# EAGLE design Mainboard (EAGLE 6.4)
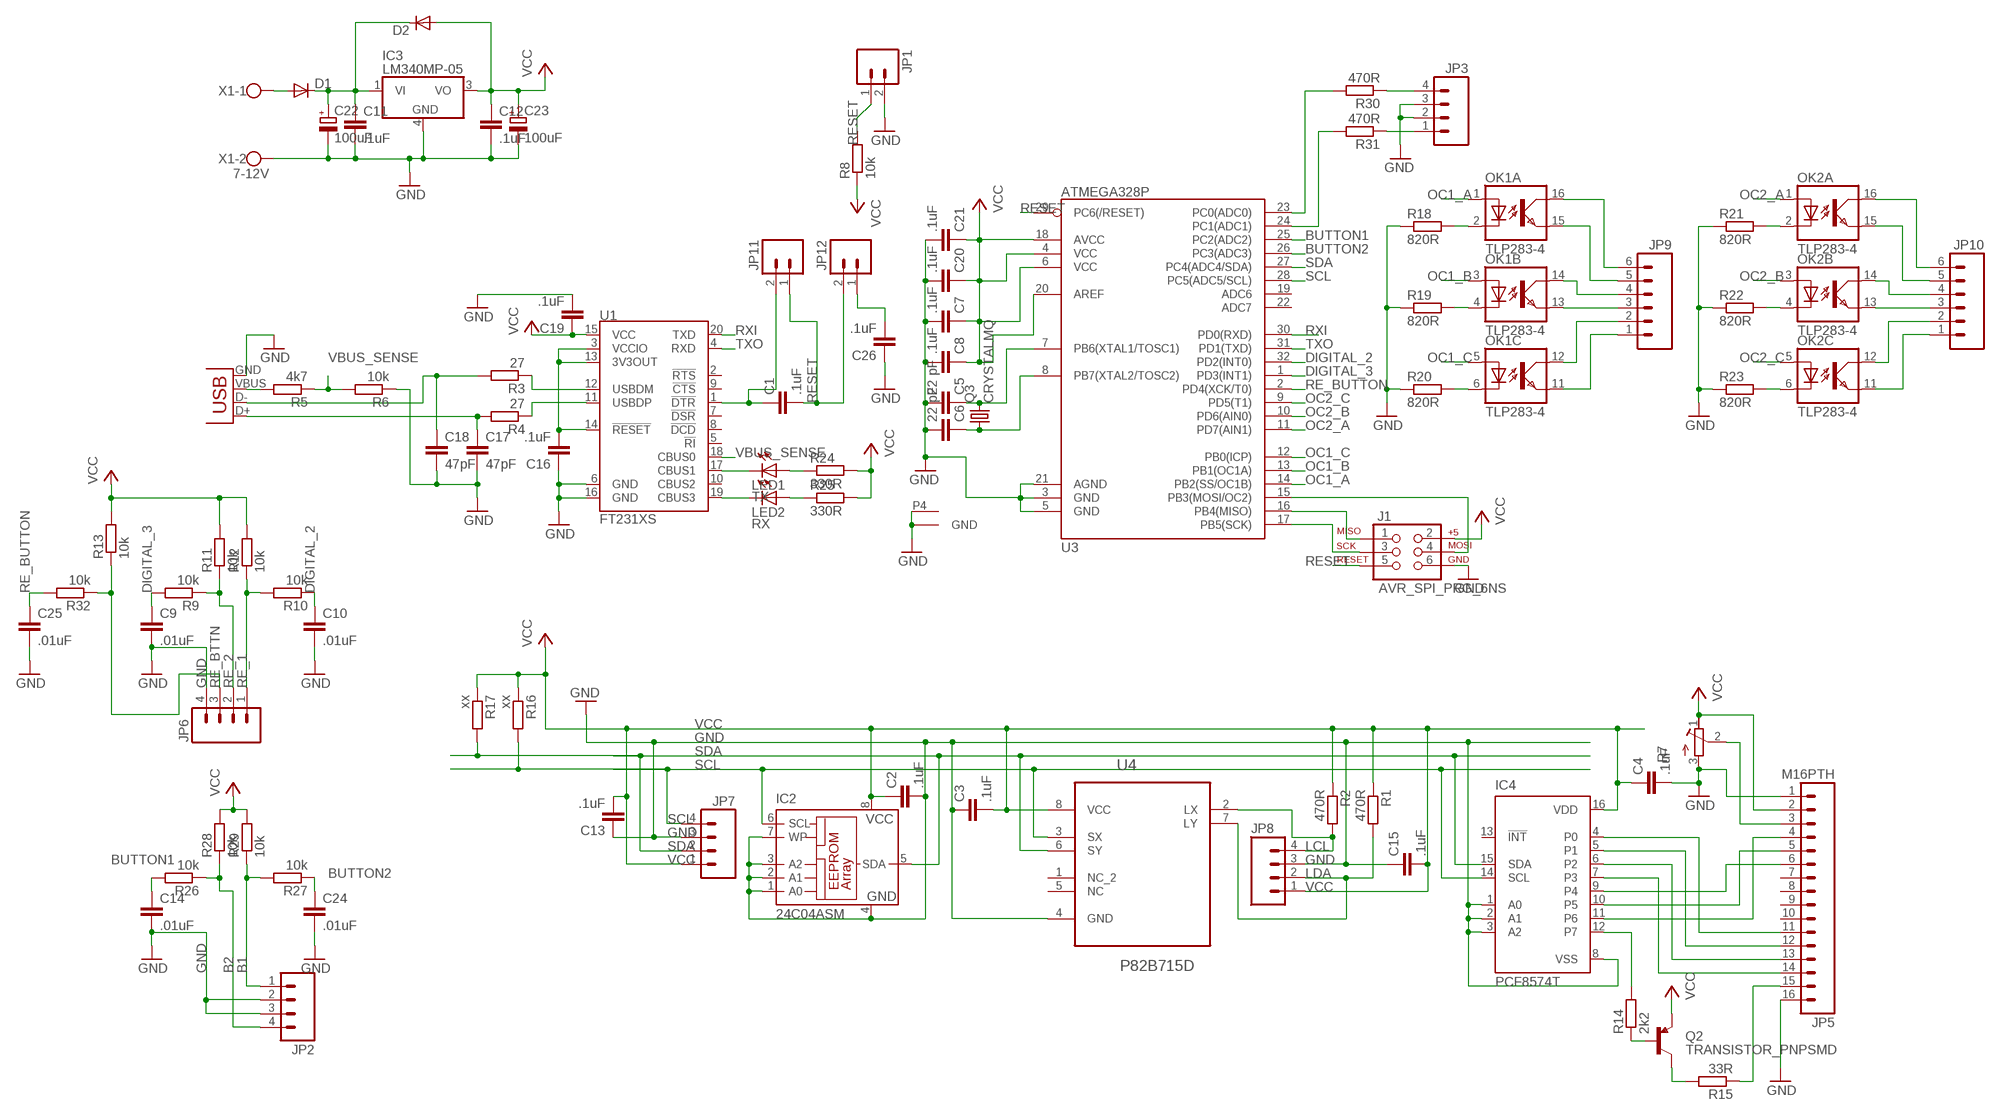
[diagram p0: schematic, sheet 1]

## Parts
C1  .1uF  C-EUC0805  [C0805]
C2  .1uF  C-EUC0805  [C0805]
C3  .1uF  C-EUC0805  [C0805]
C4  .1uF  C-EUC0805  [C0805]
C5  22 pF  C-EUC0805  [C0805]
C6  22 pF  C-EUC0805  [C0805]
C7  .1uF  C-EUC0805  [C0805]
C8  .1uF  C-EUC0805  [C0805]
C9  .01uF  C-EUC0805  [C0805]
C10  .01uF  C-EUC0805  [C0805]
C11  .1uF  C-EUC0805  [C0805]
C12  .1uF  C-EUC0805  [C0805]
C13  .1uF  C-EUC0805  [C0805]
C14  .01uF  C-EUC0805  [C0805]
C15  .1uF  C-EUC0805  [C0805]
C16  .1uF  C-EUC0805  [C0805]
C17  47pF  C-EUC0805  [C0805]
C18  47pF  C-EUC0805  [C0805]
C19  .1uF  C-EUC0805  [C0805]
C20  .1uF  C-EUC0805  [C0805]
C21  .1uF  C-EUC0805  [C0805]
C22  100uF  CPOL-EUD  [PANASONIC_D]
C23  100uF  CPOL-EUD  [PANASONIC_D]
C24  .01uF  C-EUC0805  [C0805]
C25  .01uF  C-EUC0805  [C0805]
C26  .1uF  C-EUC0805  [C0805]
D1  DIODE-MELF-MLL41  [MELF-MLL41]
D2  DIODE-MELF-MLL41  [MELF-MLL41]
IC2  24C04ASM  [SO-08M]
IC3  LM340MP-05  [SOT223]
IC4  PCF8574T  [SO16W]
J1  AVR_SPI_PRG_6NS  [2X3-NS]
JP1  M02POLAR  [MOLEX-1X2]
JP2  M04POLAR  [MOLEX-1X4]
JP3  M04PTH  [1X04]
JP4  USB-B  USBPTH  [USB-B-PTH]
JP5  M16PTH  [1X16]
JP6  M04POLAR  [MOLEX-1X4]
JP7  M04POLAR  [MOLEX-1X4]
JP8  M04POLAR  [MOLEX-1X4]
JP9  M06POLAR  [MOLEX-1X6]
JP10  M06POLAR  [MOLEX-1X6]
JP11  M02PTH  [1X02]
JP12  M02PTH  [1X02]
LED1  TX  LEDCHIPLED_0805  [CHIPLED_0805]
LED2  RX  LEDCHIPLED_0805  [CHIPLED_0805]
OK1  TLP283-4  [MINI-FLAT-16]
OK2  TLP283-4  [MINI-FLAT-16]
Q2  TRANSISTOR_PNPSMD  [SOT23-3]
Q3  CRYSTALMQ  [MQ]
R1  470R  R-EU_R0805  [R0805]
R2  470R  R-EU_R0805  [R0805]
R3  27  R-EU_R0805  [R0805]
R4  27  R-EU_R0805  [R0805]
R5  4k7  R-EU_R0805  [R0805]
R6  10k  R-EU_R0805  [R0805]
R7  R-TRIMM3314G  [RTRIM3314G]
R8  10k  R-EU_R0805  [R0805]
R9  10k  R-EU_R0805  [R0805]
R10  10k  R-EU_R0805  [R0805]
R11  10k  R-EU_R0805  [R0805]
R12  10k  R-EU_R0805  [R0805]
R13  10k  R-EU_R0805  [R0805]
R14  2k2  R-EU_R0805  [R0805]
R15  33R  R-EU_R0805  [R0805]
R16  xx  R-EU_R0805  [R0805]
R17  xx  R-EU_R0805  [R0805]
R18  820R  R-EU_R0805  [R0805]
R19  820R  R-EU_R0805  [R0805]
R20  820R  R-EU_R0805  [R0805]
R21  820R  R-EU_R0805  [R0805]
R22  820R  R-EU_R0805  [R0805]
R23  820R  R-EU_R0805  [R0805]
R24  330R  R-EU_R0805  [R0805]
R25  330R  R-EU_R0805  [R0805]
R26  10k  R-EU_R0805  [R0805]
R27  10k  R-EU_R0805  [R0805]
R28  10k  R-EU_R0805  [R0805]
R29  10k  R-EU_R0805  [R0805]
R30  470R  R-EU_R0805  [R0805]
R31  470R  R-EU_R0805  [R0805]
R32  10k  R-EU_R0805  [R0805]
U1  FT231XS  [SSOP20_L]
U3  ATMEGA328P  ATMEGA328_SMT  [TQFP32-08]
U4  P82B715D  [SOIC127P600X175-8N]
X1  7-12V  W237-102  [W237-102]

## Nets
B1: JP2.1 R27.2 R29.1
B2: JP2.4 R26.1 R28.1
BUTTON1: C14.1 R26.2 U3.25(PC2(ADC2))
BUTTON2: C24.1 R27.1 U3.26(PC3(ADC3))
D+: C17.1 JP4.D+ R4.2
D-: C18.1 JP4.D- R3.2
DIGITAL_2: C10.1 R10.1 U3.32(PD2(INT0))
DIGITAL_3: C9.1 R9.2 U3.1(PD3(INT1))
GND: C2.2 C3.1 C4.2 C5.2 C6.2 C7.2 C8.2 C9.2 C10.2 C11.2 C12.2 C13.1 C14.2 C15.1 C16.1 C17.2 C18.2 C19.2 C20.2 C21.2 C22.- C23.- C24.2 C25.2 C26.1 IC2.1(A0) IC2.2(A1) IC2.3(A2) IC2.4(GND) IC2.7(WP) IC3.4(GND) IC4.1(A0) IC4.2(A1) IC4.3(A2) IC4.8(VSS) J1.6 JP1.2 JP2.2 JP2.3 JP3.2 JP3.3 JP4.GND JP5.1 JP5.16 JP6.4 JP7.3 JP8.3 Q3.P2(GND) Q3.P4(GND1) R6.1 R7.3(A) R18.1 R19.1 R20.1 R21.1 R22.1 R23.1 U1.6(GND) U1.16(GND) U3.3(GND) U3.5(GND) U3.21(AGND) U4.4(GND) X1.2
LCL: JP8.4 R2.2 U4.2(LX)
LDA: JP8.2 R1.2 U4.7(LY)
MISO: J1.1 U3.16(PB4(MISO))
MOSI: J1.4 U3.15(PB3(MOSI/OC2))
N$1: LED2.C U1.19(CBUS3)
N$2: C1.1 JP11.2 U1.1(!DTR)
N$3: C16.2 U1.3(VCCIO) U1.13(3V3OUT) U1.14(!RESET)
N$4: JP3.4 R30.1
N$5: R3.1 U1.12(USBDM)
N$6: R4.1 U1.11(USBDP)
N$7: JP3.1 R31.1
N$8: R30.2 U3.23(PC0(ADC0))
N$9: R31.2 U3.24(PC1(ADC1))
N$10: Q2.1(B) R14.1
N$11: JP9.1 OK1.11(C:EMIT)
N$12: JP5.3 R7.2(S)
N$13: C11.1 C22.+ D1.C D2.C IC3.1(VI)
N$14: IC4.11(P6) JP5.4
N$15: IC4.10(P5) JP5.5
N$16: IC4.9(P4) JP5.6
N$17: IC4.4(P0) JP5.11
N$18: IC4.5(P1) JP5.12
N$19: IC4.6(P2) JP5.13
N$20: IC4.7(P3) JP5.14
N$21: C5.1 Q3.P3 U3.7(PB6(XTAL1/TOSC1))
N$22: C6.1 Q3.P1 U3.8(PB7(XTAL2/TOSC2))
N$23: IC4.12(P7) R14.2
N$24: JP5.15 R15.1
N$25: Q2.3(C) R15.2
N$26: OK1.2(A:C) R18.2
N$27: OK1.4(B:C) R19.2
N$28: OK1.6(C:C) R20.2
N$29: OK2.2(A:C) R21.2
N$30: OK2.4(B:C) R22.2
N$31: OK2.6(C:C) R23.2
N$32: LED1.C U1.17(CBUS1)
N$33: D1.A X1.1
N$34: JP9.2 OK1.12(C:COL)
N$35: LED1.A R24.1
N$36: LED2.A R25.1
N$37: JP9.3 OK1.13(B:EMIT)
N$38: JP9.4 OK1.14(B:COL)
N$39: JP9.5 OK1.15(A:EMIT)
N$40: JP9.6 OK1.16(A:COL)
N$41: JP10.3 OK2.13(B:EMIT)
N$42: JP10.4 OK2.14(B:COL)
N$43: JP10.5 OK2.15(A:EMIT)
N$44: JP10.6 OK2.16(A:COL)
N$45: JP10.2 OK2.12(C:COL)
N$46: JP10.1 OK2.11(C:EMIT)
N$48: C26.2 JP12.1
OC1_A: OK1.1(A:A) U3.14(PB2(SS/OC1B))
OC1_B: OK1.3(B:A) U3.13(PB1(OC1A))
OC1_C: OK1.5(C:A) U3.12(PB0(ICP))
OC2_A: OK2.1(A:A) U3.11(PD7(AIN1))
OC2_B: OK2.3(B:A) U3.10(PD6(AIN0))
OC2_C: OK2.5(C:A) U3.9(PD5(T1))
RE_1: JP6.1 R10.2 R12.1
RE_2: JP6.2 R9.1 R11.1
RE_BTTN: JP6.3 R13.1 R32.1
RE_BUTTON: C25.1 R32.2 U3.2(PD4(XCK/T0))
RESET: C1.2 J1.5 JP1.1 JP11.1 JP12.2 R8.2 U3.29(PC6(/RESET))
RXI: U1.20(TXD) U3.30(PD0(RXD))
SCK: J1.3 U3.17(PB5(SCK))
SCL: IC2.6(SCL) IC4.14(SCL) JP7.4 R16.2 U3.28(PC5(ADC5/SCL)) U4.3(SX)
SDA: IC2.5(SDA) IC4.15(SDA) JP7.2 R17.2 U3.27(PC4(ADC4/SDA)) U4.6(SY)
TXO: U1.4(RXD) U3.31(PD1(TXD))
VBUS: JP4.VBUS R5.2
VBUS_SENSE: R5.1 R6.2 U1.18(CBUS0)
VCC: C2.1 C3.2 C4.1 C7.1 C8.1 C12.1 C13.2 C15.2 C19.1 C20.1 C21.1 C23.+ D2.A IC2.8(VCC) IC3.3(VO) IC4.16(VDD) J1.2 JP5.2 JP7.1 JP8.1 Q2.2(E) R1.1 R2.1 R7.1(E) R8.1 R11.2 R12.2 R13.2 R16.1 R17.1 R24.2 R25.2 R28.2 R29.2 U1.15(VCC) U3.4(VCC) U3.6(VCC) U3.18(AVCC) U3.20(AREF) U4.8(VCC)
Unconnected: IC4.13(!INT) JP5.7 JP5.8 JP5.9 JP5.10 OK1.7(D:A) OK1.8(D:C) OK1.9(D:EMIT) OK1.10(D:COL) OK2.7(D:A) OK2.8(D:C) OK2.9(D:EMIT) OK2.10(D:COL) U1.2(!RTS) U1.5(!RI) U1.7(!DSR) U1.8(!DCD) U1.9(!CTS) U1.10(CBUS2) U3.19(ADC6) U3.22(ADC7) U4.1(NC_2) U4.5(NC)

## Library data of the parts
C1-C4 C7 C8 C11-C13 C15 C16 C19-C21 C26 = rcl:C-EU: CAPACITOR, European symbol; MPN: 2222 370 21104; OC_NEWARK: 98K6987
C5 C6 = rcl:C-EU: CAPACITOR, European symbol; MPN: 02013A220JAT2A; OC_NEWARK: 10R5907
C9 C10 C14 C24 C25 = rcl:C-EU: CAPACITOR, European symbol; MPN: B32529C103K; OC_NEWARK: 21C0458
C17 C18 = rcl:C-EU: CAPACITOR, European symbol; OC_NEWARK: unknown
C22 C23 = rcl:CPOL-EU: POLARIZED CAPACITOR, European symbol
D1 D2 = diode:DIODE-: DIODE
IC2 = microchip:24*: Serial EEPROM I2C; MPN: M24C04-WMN6P; OC_FARNELL: 9882812; OC_NEWARK: 83K1376
IC3 = linear:LM340?-*: Positive VOLTAGE REGULATOR Source: http://cache.national.com/ds/LM/LM340.pdf
IC4 = micro-philips:PCF8574: I2C-Bus Remote 8-bit I/O expander http://www.semiconductors.philips.com/acrobat_download/datasheets/PCF8574_4.pdf; MPN: PCF8574T/3,512; OC_FARNELL: 1201255; OC_NEWARK: 70R6870
J1 = SparkFun-Connectors:AVR_SPI_PRG_6: AVR ISP 6 Pin This is the reduced ISP connector for AVR programming. Common on Arduino. This footprint will take up less PCB space and can be used with a 10-pin to 6-pin adapter such as SKU: BOB-08508
JP1 JP11 JP12 = SparkFun-Connectors:M02: Header 2 Standard 2-pin 0.1" header. Use with straight break away headers (SKU : PRT-00116), right angle break away headers (PRT-00553), swiss pins (PRT-00743), machine pins (PRT-00117), and female headers (PRT-00115). Molex polarized connector foot print use with SKU : PRT-08233 with associated crimp pins and housings.
JP2 JP3 JP6-JP8 = SparkFun-Connectors:M04: Header 4 Standard 4-pin 0.1" header. Use with straight break away headers (SKU : PRT-00116), right angle break away headers (PRT-00553), swiss pins (PRT-00743), machine pins (PRT-00117), and female headers (PRT-00115). Molex polarized connector foot print use with SKU : PRT-08231 with associated crimp pins and housings. 1MM SMD Version SKU: PRT-10208
JP4 = SparkFun-Connectors:USB: USB Connectors USB-B-PTH is fully proven SKU : PRT-00139/CONN-08278 USB-miniB is fully proven SKU : PRT-00587 USB-A-PCB is untested. USB-A-H is throughly reviewed, but untested. Spark Fun Electronics SKU : PRT-00437 USB-B-SMT is throughly reviewed, but untested. Needs silkscreen touching up. USB-A-S has not been used/tested USB-MB-H has not been used/tested USB-MICROB has been used. CONN-09505; OC_NEWARK: unknown; PROD_ID: CONN-08278
JP5 = SparkFun-Connectors:M16: 1x16 .1" header
JP9 JP10 = SparkFun-Connectors:M06: Header 6 Standard 6-pin 0.1" header. Use with straight break away headers (SKU : PRT-00116), right angle break away headers (PRT-00553), swiss pins (PRT-00743), machine pins (PRT-00117), and female headers (PRT-00115). Molex polarized connector foot print use with SKU : PRT-08094 with associated crimp pins and housings. NOTES ON THE VARIANTS LOCK and LOCK_LONGPADS... This footprint was designed to help hold the alignment of a through-hole component (i.e. 6-pin header) while soldering it into place. You may notice that each hole has been shifted either up or down by 0.005 of an inch from it's more standard position (which is a perfectly straight line). This slight alteration caused the pins (the squares in the middle) to touch the edges of the holes. Because they are alternating, it causes a "brace" to hold the component in place. 0.005 has proven to be the perfect amount of "off-center" position when using our standard breakaway headers. Although looks a little odd when you look at the bare footprint, once you have a header in there, the alteration is very hard to notice. Also, if you push a header all the way into place, it is covered up entirely on the bottom side. This idea of altering the position of holes to aid alignment will be further integrated into the Sparkfun Library for other footprints. It can help hold any component with 3 or more connection pins.
LED1 LED2 = adafruit:LED: LED OSRAM: - CHIPLED LG R971, LG N971, LY N971, LG Q971, LY Q971, LO R971, LY R971 LH N974, LH R974 LS Q976, LO Q976, LY Q976 LO Q996 - Hyper CHIPLED LW Q18S LB Q993, LB Q99A, LB R99A - SideLED LS A670, LO A670, LY A670, LG A670, LP A670 LB A673, LV A673, LT A673, LW A673 LH A674 LY A675 LS A676, LA A676, LO A676, LY A676, LW A676 LS A679, LY A679, LG A679 - Hyper Micro SIDELED® LS Y876, LA Y876, LO Y876, LY Y876 LT Y87S - SmartLED LW L88C, LW L88S LB L89C, LB L89S, LG L890 LS L89K, LO L89K, LY L89K LS L896, LA L896, LO L896, LY L896 - TOPLED LS T670, LO T670, LY T670, LG T670, LP T670 LSG T670, LSP T670, LSY T670, LOP T670, LYG T670 LG T671, LOG T671, LSG T671 LB T673, LV T673, LT T673, LW T673 LH T674 LS T676, LA T676, LO T676, LY T676, LB T676, LH T676, LSB T676, LW T676 LB T67C, LV T67C, LT T67C, LS T67K, LO T67K, LY T67K, LW E67C LS E67B, LA E67B, LO E67B, LY E67B, LB E67C, LV E67C, LT E67C LW T67C LS T679, LY T679, LG T679 LS T770, LO T770, LY T770, LG T770, LP T770 LB T773, LV T773, LT T773, LW T773 LH T774 LS E675, LA E675, LY E675, LS T675 LS T776, LA T776, LO T776, LY T776, LB T776 LHGB T686 LT T68C, LB T68C - Hyper Mini TOPLED® LB M676 - Mini TOPLED Santana® LG M470 LS M47K, LO M47K, LY M47K Source: http://www.osram.convergy.de/
OK1 OK2 = optocoupler:TLP283-4: TOSHIBA PHOTOCOUPLER GaAs IRED & PHOTO-TRANSISTOR Source: http://www.semicon.toshiba.co.jp/td/en/Opto/Photocoupler/en_20050928_TLP283_datasheet.pdf; OC_FARNELL: unknown; OC_NEWARK: unknown
Q2 = SparkFun-DiscreteSemi:TRANSISTOR_PNP: Generic PNP BJT. Double check pinouts against datasheets- not all devices are the same!
Q3 = Crystals-new:CRYSTAL
R1-R5 R16-R25 = rcl:R-EU_: RESISTOR, European symbol; OC_NEWARK: unknown
R6 R8-R15 R26-R32 = rcl:R-EU_: RESISTOR, European symbol; MF: VISHAY/SPECTRO; MPN: 043P103; OC_NEWARK: 01F8187
R7 = rcl:R-TRIMM: Trimm resistor
U1 = SparkFun-DigitalIC:FT231X: FTDI FT231X Full Speed USB to Full-handshake UART This USB2.0 Full Speed IC offers a compact bridge to full handshake UART interfaces. The device is a UART, capable of operating up to 3MBaud, with low power consumption (8mA). The FT231X includes the complete FT-X series feature set and enables USB to be added into a system design quickly and easily over a UART interface.; OC_NEWARK: unknown
U3 = SparkFun-DigitalIC:ATMEGA328_SMT: 32-Pin Atmega328 part Commonly used on Arduino compatible boards Available in QFP and QFN packages TQFP is IC-09069 QFN is non-stock; OC_NEWARK: unknown; PROD_ID: IC-09069
U4 = Texas Instruments_By_element14_Batch_1:P82B715D: I2C BUS EXTENDER; MPN: P82B715D; OC_FARNELL: 1604945; OC_NEWARK: 84M9793; PACKAGE: SOIC-8; SUPPLIER: Texas Instruments
X1 = con-wago-500:W237-102: WAGO SCREW CLAMP; MPN: 237-102; OC_FARNELL: unknown; OC_NEWARK: unknown

## Board
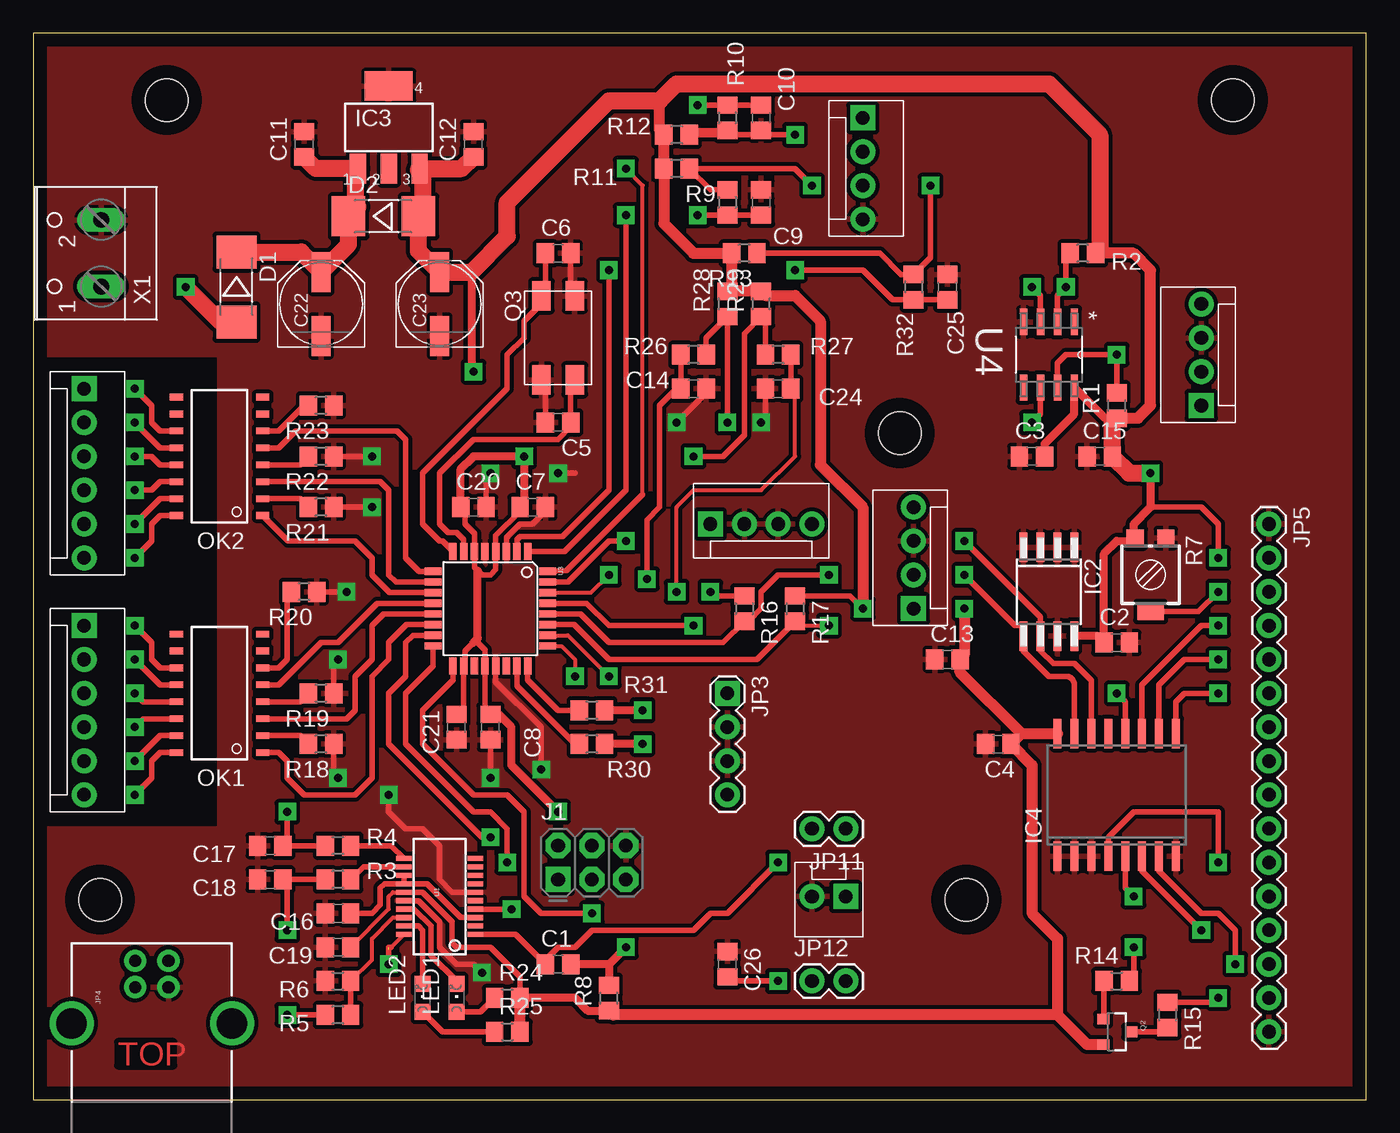
[diagram p1: board, top side]
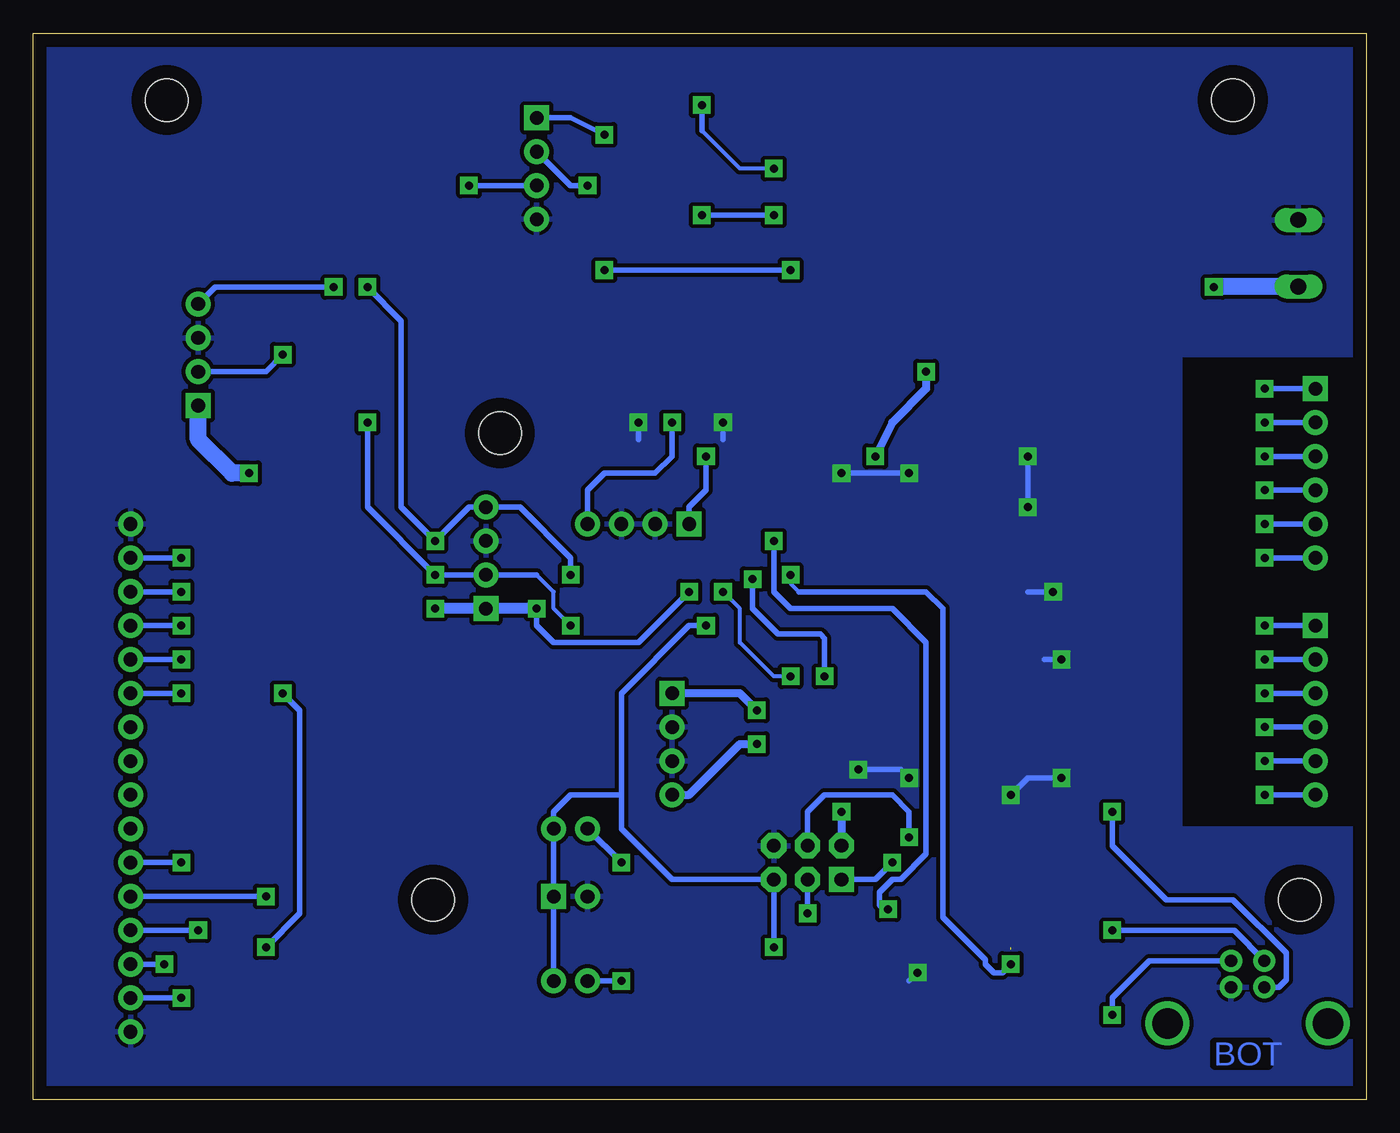
[diagram p2: board, bottom side, seen from below]

Size 100 x 80 mm. Coordinates in mm from the lower left corner, seen from the top.
Outline: 0,0 100,0 100,80 0,80 0,0
Copper layers (1*16): Top 0.035mm / dielectric 1.5mm / Bottom 0.035mm
Design rules "default *": minimum track width 10mil, minimum drill 24mil, track to track 8mil, track to pad 8mil, pad to pad 8mil, via to via 8mil, smd to smd 8mil, copper to edge 40mil, drill to drill 8mil, minimum pad ring 10mil, minimum via ring 8mil, stop-mask expansion 4mil, vias tented up to drill 0mil, thermal gap 10mil
Holes 3.2 mm at 10,75 90,75 70,15 5,15 65,50

### Footprints (pad centres in the part's own frame; a part is rotated, then mirrored left to right if it is on the bottom)
C0805 = smd 1.3 x 1.5: 1 -0.95,0; 2 0.95,0
PANASONIC_D = smd 3 x 1.4: + 2.4,0; - -2.4,0
MELF-MLL41 = smd 2.5 x 3: A 2.625,0; C -2.625,0
SO-08M = smd 0.6 x 2.2: 1 -1.905,-3.33; 2 -0.635,-3.33; 3 0.635,-3.33; 4 1.905,-3.33; 5 1.905,3.33; 6 0.635,3.33; 7 -0.635,3.33; 8 -1.905,3.33
SOT223 = smd 1.219 x 2.235: 1 -2.311,-3.099; 2 0,-3.099; 3 2.311,-3.099 | smd 3.6 x 2.2: 4 0,3.099
SO16W = smd 0.6 x 2.2: 1 -4.445,-4.6; 2 -3.175,-4.6; 3 -1.905,-4.6; 4 -0.635,-4.6; 5 0.635,-4.6; 6 1.905,-4.6; 7 3.175,-4.6; 8 4.445,-4.6; 9 4.445,4.6; 10 3.175,4.6; 11 1.905,4.6; 12 0.635,4.6; 13 -0.635,4.6; 14 -1.905,4.6; 15 -3.175,4.6; 16 -4.445,4.6
2X3-NS = drill 1.016 pad 1.88 square: 1 -2.54,-1.27 | drill 1.016 pad 1.88 octagon: 2 -2.54,1.27; 3 0,-1.27; 4 0,1.27; 5 2.54,-1.27; 6 2.54,1.27
MOLEX-1X2 = drill 1.016 pad 1.88 square: 1 0,0 | drill 1.016 pad 1.88: 2 2.54,0
MOLEX-1X4 = drill 1.016 pad 1.88 square: 1 0,0 | drill 1.016 pad 1.88: 2 2.54,0; 3 5.08,0; 4 7.62,0
1X04 = drill 1.016 pad 1.88 square: 1 0,0 | drill 1.016 pad 1.88: 2 2.54,0; 3 5.08,0; 4 7.62,0
USB-B-PTH = drill 0.914 pad 1.676: D+ 0,1.25; D- 1.981,1.25; GND 0,-1.25; VBUS 1.981,-1.25 | drill 2.286: S1 -2.718,-6.02; S2 -2.718,6.02
1X16 = drill 1.016 pad 1.88: 1 0,0; 2 2.54,0; 3 5.08,0; 4 7.62,0; 5 10.16,0; 6 12.7,0; 7 15.24,0; 8 17.78,0; 9 20.32,0; 10 22.86,0; 11 25.4,0; 12 27.94,0; 13 30.48,0; 14 33.02,0; 15 35.56,0; 16 38.1,0
MOLEX-1X6 = drill 1.016 pad 1.88 square: 1 0,0 | drill 1.016 pad 1.88: 2 2.54,0; 3 5.08,0; 4 7.62,0; 5 10.16,0; 6 12.7,0
1X02 = drill 1.016 pad 1.88: 1 0,0; 2 2.54,0
CHIPLED_0805 = smd 1.2 x 1.2: A 0,-1.05; C 0,1.05
MINI-FLAT-16 = smd 1 x 0.5: 1 -3.24,4.445; 2 -3.24,3.175; 3 -3.24,1.905; 4 -3.24,0.635; 5 -3.24,-0.635; 6 -3.24,-1.905; 7 -3.24,-3.175; 8 -3.24,-4.445; 9 3.24,-4.445; 10 3.24,-3.175; 11 3.24,-1.905; 12 3.24,-0.635; 13 3.24,0.635; 14 3.24,1.905; 15 3.24,3.175; 16 3.24,4.445
SOT23-3 = smd 0.8 x 0.9: 1 -0.95,-1; 2 0.95,-1; 3 0,1.1
MQ = smd 2.2 x 1.4: P1 -3.15,-1.25; P2 3.15,-1.25; P3 3.15,1.25; P4 -3.15,1.25
R0805 = smd 1.3 x 1.5: 1 -0.95,0; 2 0.95,0
RTRIM3314G = smd 1.3 x 1.3: 1 1.15,-2.75; 3 -1.15,-2.75 | smd 2 x 1.3: 2 0,2.75
SSOP20_L = smd 0.381 x 1.143: 1 -2.857,-2.68; 2 -2.223,-2.68; 3 -1.587,-2.68; 4 -0.953,-2.68; 5 -0.318,-2.68; 6 0.318,-2.68; 7 0.953,-2.68; 8 1.587,-2.68; 9 2.223,-2.68; 10 2.857,-2.68; 11 2.857,2.68; 12 2.223,2.68; 13 1.587,2.68; 14 0.953,2.68; 15 0.318,2.68; 16 -0.318,2.68; 17 -0.953,2.68; 18 -1.587,2.68; 19 -2.223,2.68; 20 -2.857,2.68
TQFP32-08 = smd 1.27 x 0.559: 1 -4.293,2.8; 2 -4.293,2; 3 -4.293,1.2; 4 -4.293,0.4; 5 -4.293,-0.4; 6 -4.293,-1.2; 7 -4.293,-2; 8 -4.293,-2.8; 17 4.293,-2.8; 18 4.293,-2; 19 4.293,-1.2; 20 4.293,-0.4; 21 4.293,0.4; 22 4.293,1.2; 23 4.293,2; 24 4.293,2.8 | smd 0.559 x 1.27: 9 -2.8,-4.293; 10 -2,-4.293; 11 -1.2,-4.293; 12 -0.4,-4.293; 13 0.4,-4.293; 14 1.2,-4.293; 15 2,-4.293; 16 2.8,-4.293; 25 2.8,4.293; 26 2,4.293; 27 1.2,4.293; 28 0.4,4.293; 29 -0.4,4.293; 30 -1.2,4.293; 31 -2,4.293; 32 -2.8,4.293
SOIC127P600X175-8N = smd 1.981 x 0.559: 1 -2.464,1.905; 2 -2.464,0.635; 3 -2.464,-0.635; 4 -2.464,-1.905; 5 2.464,-1.905; 6 2.464,-0.635; 7 2.464,0.635; 8 2.464,1.905
W237-102 = drill 1.194 long: 1 -2.5,-1.27; 2 2.5,-1.27

### Placement (x,y rotation side)
C1  39.37,10.16 0 top
C2  81.28,34.29 0 top
C3  74.93,48.26 0 top
C4  72.39,26.67 180 top
C5  39.37,50.8 180 top
C6  39.37,63.5 0 top
C7  37.47,44.45 0 top
C8  34.29,27.94 270 top
C9  54.61,67.31 90 top
C10  54.61,73.66 270 top
C11  20.32,71.67 90 top
C12  33.02,71.67 90 top
C13  68.58,33.02 0 top
C14  49.53,53.34 0 top
C15  80.01,48.26 0 top
C16  22.86,13.97 0 top
C17  17.78,19.05 180 top
C18  17.78,16.51 180 top
C19  22.86,11.43 180 top
C20  33.02,44.45 0 top
C21  31.75,27.94 270 top
C22  21.59,59.69 90 top
C23  30.48,59.69 90 top
C24  55.88,53.34 180 top
C25  68.58,60.96 90 top
C26  52.07,10.16 270 top
D1  15.24,60.96 270 top
D2  26.27,66.27 0 top
IC2  76.2,38.1 180 top
IC3  26.67,72.94 0 top
IC4  81.28,22.86 0 top
J1  41.91,17.78 0 top
JP1  60.96,15.24 180 top
JP2  50.8,43.18 0 top
JP3  52.07,30.48 270 top
JP4  8.89,8.43 90 top
JP5  92.71,43.18 270 top
JP6  62.23,73.66 270 top
JP7  66.04,36.83 90 top
JP8  87.63,52.07 90 top
JP9  3.81,35.56 270 top
JP10  3.81,53.34 270 top
JP11  60.96,20.32 180 top
JP12  58.42,8.89 0 top
LED1  31.75,7.62 0 top
LED2  29.21,7.62 0 top
OK1  13.97,30.48 180 top
OK2  13.97,48.26 180 top
Q2  81.28,5.08 270 top
Q3  39.37,57.15 270 top
R1  81.28,52.07 90 top
R2  78.74,63.5 180 top
R3  22.86,16.51 180 top
R4  22.86,19.05 180 top
R5  22.86,6.35 180 top
R6  22.86,8.89 0 top
R7  83.82,39.37 180 top
R8  43.18,7.62 90 top
R9  52.07,67.31 270 top
R10  52.07,73.66 270 top
R11  48.26,69.85 180 top
R12  48.26,72.39 180 top
R13  53.34,63.5 180 top
R14  81.28,8.89 0 top
R15  85.09,6.35 270 top
R16  53.34,36.83 270 top
R17  57.15,36.83 270 top
R18  21.59,26.67 180 top
R19  21.59,30.48 180 top
R20  20.32,38.1 180 top
R21  21.59,44.45 180 top
R22  21.59,48.26 180 top
R23  21.59,52.07 180 top
R24  35.56,7.62 0 top
R25  35.56,5.08 0 top
R26  49.53,55.88 180 top
R27  55.88,55.88 180 top
R28  52.07,59.69 90 top
R29  54.61,59.69 90 top
R30  41.91,26.67 180 top
R31  41.91,29.21 180 top
R32  66.04,60.96 270 top
U1  30.48,15.24 90 top
U3  34.29,36.83 270 top
U4  76.2,55.88 270 top
X1  3.81,63.5 90 top

### Tracks (layer width: path | path; a pad name or v marks a point on that pad's centre or on a via)
B1  (via drill 0.6)
  Top 0.406: R27.2 54.93,58.42 R29.1 53.34,57.47 53.34,49.85 51.75,48.26 v49.53,48.26
  Bottom 0.406: JP2.1 50.8,44.45 49.53,45.72 v49.53,48.26
B2  (via drill 0.6)
  Top 0.406: R26.1 50.48,57.15 R28.1 v52.07,50.8
  Bottom 0.406: JP2.4 58.42,45.72 57.15,46.99 53.34,46.99 52.07,48.26 v52.07,50.8
BUTTON1  (via drill 0.6)
  Top 0.305: U3.25 39.63,34.03 40.64,33.02 v40.64,31.75
  Top 0.406: R26.2 C14.1 48.26,53.34 46.99,52.07 46.99,44.45 46.04,43.5 v46.04,39.05
  Bottom 0.406: v40.64,31.75 40.64,34.61 40.96,34.92 44.13,34.92 46.04,36.83 v46.04,39.05
BUTTON2  (via drill 0.6)
  Top 0.305: U3.26 40.1,34.83 v43.18,31.75 | v48.26,38.1 48.26,44.45 49.53,45.72 54.61,45.72 57.15,48.26 57.15,53.02 C24.1
  Top 0.406: C24.1 R27.1
  Bottom 0.305: v43.18,31.75 44.45,31.75 46.99,34.29 46.99,36.83 v48.26,38.1
D+  (via drill 0.6)
  Top 0.406: R4.2 C17.1 19.05,19.37 v19.05,21.59
  Bottom 0.406: v19.05,21.59 19.05,19.05 15,15 10,15 6,11 6,9 6.57,8.43 JP4.D+
D-  (via drill 0.6)
  Top 0.406: R3.2 C18.1 19.05,16.19 v19.05,12.7
  Bottom 0.406: v19.05,12.7 19.03,12.68 9.91,12.68 JP4.D-
DIGITAL_2  (via drill 0.6)
  Top 0.305: 45.72,45.4 45.72,68.58 v44.45,69.85
  Top 0.406: C10.1 R10.1 v49.85,74.61 | U3.32 40.01,39.69 45.72,45.4
  Bottom 0.305: v44.45,69.85 46.99,69.85 49.85,72.71
  Bottom 0.406: 49.85,72.71 v49.85,74.61
DIGITAL_3  (via drill 0.6)
  Top 0.406: C9.1 R9.2 v49.85,66.36 | U3.1 39.85,41.12 44.45,45.72 v44.45,66.36
  Bottom 0.406: v44.45,66.36 v49.85,66.36
GND  (via drill 0.6)
  Top 0.406: C6.2 40.32,60.6 Q3.P4 | C5.2 38.42,53.7 Q3.P2 | U3.3 35.49,42.16 36.51,43.18 37.47,43.18 38.1,43.81 38.1,44.13 C7.2 | R22.1 v25.4,48.26 | C14.2 50.48,53.02 v48.26,50.8 | C24.2 54.93,51.12 v54.61,50.8 | R18.1 22.54,24.45 v22.86,24.13 | R19.1 22.54,32.7 v22.86,33.02 | R20.1 v23.5,38.1 | v26.67,22.86 26.67,21.59 27.94,20.32 29.21,20.32 30.48,19.05 30.48,16.51 31.43,15.56 U1.6 | v33.66,9.53 33.02,10.16 31.75,10.16 30.48,11.43 30.48,13.34 28.89,14.92 U1.16 | C20.2 33.97,46.67 v34.29,46.99 | v39.37,46.99 40.64,46.99 | R21.1 v25.4,44.45 | U3.21 34.69,31.35 38.1,27.94 v38.1,24.77 | v34.29,24.13 C8.2
  Bottom 0.406: v48.26,50.8 48.26,49.53 | v54.61,50.8 54.61,49.53 | v22.86,33.02 24.13,33.02 | v23.5,38.1 25.4,38.1 | v22.86,24.13 25.4,24.13 v26.67,22.86 | 34.29,8.89 v33.66,9.53 | v34.29,46.99 v39.37,46.99 | v25.4,44.45 v25.4,48.26 | v38.1,24.77 34.92,24.77 v34.29,24.13
  pour Top (isolate 0.305): 0,20.32 0,0 100.33,0 100.33,80.01 0,80.01 0,55.88 13.97,55.88 13.97,20.32
  pour Bottom (isolate 0.305): 0,0 100.33,0 100.33,80.01 0,80.01 0,55.88 13.97,55.88 13.97,20.32 0,20.32
LCL  (via drill 0.6)
  Top 0.406: U4.2 76.83,60.33 v77.47,60.96 77.47,63.18 R2.2
  Bottom 0.406: JP8.4 86.36,60.96 v77.47,60.96
LDA  (via drill 0.6)
  Top 0.406: U4.7 76.83,55.24 77.47,55.88 v81.28,55.88 R1.2
  Bottom 0.406: v81.28,55.88 82.55,54.61 JP8.2
MISO  (via drill 0.6)
  Top 0.406: U3.16 30,32.54 27.94,30.48 27.94,26.67 33.02,21.59 34.29,21.59 35.56,20.32 v35.56,17.78
  Bottom 0.406: v35.56,17.78 36.83,16.51 J1.1
MOSI  (via drill 0.6)
  Top 0.406: U3.15 28.48,34.83 27.94,34.29 27.94,31.75 26.67,30.48 26.67,26.67 33.66,19.68 v34.29,19.68
  Bottom 0.406: J1.4 41.91,21.59 40.64,22.86 35.56,22.86 34.29,21.59 v34.29,19.68
N$1
  Top 0.406: U1.19 28.89,13.02 29.21,12.7 LED2.C
N$2  (via drill 0.6)
  Top 0.406: U1.1 36.2,12.38 C1.1 38.42,10.48 39.37,11.43 40.64,11.43 41.91,12.7 49.53,12.7 50.8,13.97 52.07,13.97 v55.88,17.78
  Bottom 0.406: v55.88,17.78 JP11.2
N$3
  Top 0.406: C16.2 25.4,13.97 26.04,14.61 26.04,15.88 26.35,16.19 U1.14 | U1.14 U1.13 | U1.14 29.53,16.19 32.07,13.65 U1.3
N$4  (via drill 0.6)
  Top 0.61: v45.72,26.67 R30.1
  Bottom 0.61: JP3.4 50.8,22.86 46.99,26.67 v45.72,26.67
N$5
  Top 0.406: R3.1 24.76,17.46 U1.12
N$6
  Top 0.406: U1.11 26.85,19.05 R4.1
N$7  (via drill 0.6)
  Top 0.61: v45.72,29.21 R31.1
  Bottom 0.61: v45.72,29.21 46.99,30.48 JP3.1
N$8
  Top 0.406: U3.23 36.29,31.02 40.64,26.67 R30.2
N$9
  Top 0.406: U3.24 37.09,31.49 39.37,29.21 R31.2
N$10
  Top 0.406: Q2.1 80.33,6.08 R14.1
N$11  (via drill 0.6)
  Top 0.406: OK1.11 9.53,32.38 8.89,33.02 8.89,34.29 v7.62,35.56
  Bottom 0.406: v7.62,35.56 JP9.1
N$12  (via drill 0.6)
  Top 0.406: R7.2 87.42,36.62 v88.9,38.1
  Bottom 0.406: v88.9,38.1 JP5.3
N$13
  Top 1.27: 21.36,62.31 C22.+ | C11.1 21.2,69.85 IC3.1 24.13,69.62 24.13,66.04 23.9,66.27 D2.C | D1.C 20.09,63.59 C22.+ | C22.+ 23.64,64.14 D2.C | D2.C 24.36,66.98
N$14  (via drill 0.6)
  Top 0.406: IC4.11 83.19,31.11 87.63,35.56 v88.9,35.56
  Bottom 0.406: v88.9,35.56 JP5.4
N$15  (via drill 0.6)
  Top 0.406: IC4.10 84.45,31.11 86.36,33.02 v88.9,33.02
  Bottom 0.406: v88.9,33.02 JP5.5
N$16  (via drill 0.6)
  Top 0.406: IC4.9 85.72,29.84 86.36,30.48 v88.9,30.48
  Bottom 0.406: v88.9,30.48 JP5.6
N$17  (via drill 0.6)
  Top 0.406: v88.9,17.78 88.9,21.59 82.55,21.59 80.64,19.68 IC4.4
  Bottom 0.406: JP5.11 v88.9,17.78
N$18  (via drill 0.6)
  Top 0.406: IC4.5 81.92,15.88 v82.55,15.24
  Bottom 0.406: v82.55,15.24 JP5.12
N$19  (via drill 0.6)
  Top 0.406: IC4.6 83.19,17.14 v87.63,12.7
  Bottom 0.406: v87.63,12.7 JP5.13
N$20  (via drill 0.6)
  Top 0.406: v90.17,10.16 90.17,12.7 88.9,13.97 87.63,13.97 84.45,17.14 IC4.7
  Bottom 0.406: JP5.14 v90.17,10.16
N$21
  Top 0.406: Q3.P3 40.32,53.7 C5.1 40.32,50.48 39.37,49.53 33.02,49.53 30.48,46.99 30.48,43.18 31.11,42.55 31.75,42.55 32.29,42.01 U3.7
N$22
  Top 0.406: C6.1 38.42,60.6 Q3.P1 38.1,60.28 38.1,59.69 36.83,58.42 36.83,57.15 35.56,55.88 35.56,53.34 29.21,46.99 29.21,43.18 30.48,41.91 30.7,41.91 U3.8
N$23  (via drill 0.6)
  Top 0.406: IC4.12 81.92,29.84 v81.28,30.48 | v82.55,11.43 82.55,9.21 R14.2
  Bottom 0.406: v82.55,11.43 80.01,13.97 80.01,29.21 v81.28,30.48
N$24  (via drill 0.6)
  Top 0.406: R15.1 88.58,7.3 v88.9,7.62
  Bottom 0.406: v88.9,7.62 JP5.15
N$25
  Top 0.406: Q2.3 84.77,5.08 R15.2
N$26
  Top 0.406: OK1.2 20,27.3 R18.2
N$27
  Top 0.406: OK1.4 20,29.84 R19.2
N$28
  Top 0.406: OK1.6 18.41,32.38 19.05,33.02 19.05,35.56 19.05,36.51 19.05,37.78 R20.2
N$29
  Top 0.406: OK2.2 20,45.09 R21.2
N$30
  Top 0.406: OK2.4 20,47.62 R22.2
N$31
  Top 0.406: OK2.6 18.41,50.16 20.32,52.07 R23.2
N$32
  Top 0.406: LED1.C 31.75,8.89 29.84,10.79 29.84,13.02 28.57,14.29 U1.17
N$33  (via drill 0.6)
  Top 1.27: v11.43,60.96 13.97,58.42 15.15,58.42 D1.A
  Bottom 1.27: X1.1 11.39,61 v11.43,60.96
N$34  (via drill 0.6)
  Top 0.406: v7.62,33.02 9.53,31.11 OK1.12
  Bottom 0.406: JP9.2 v7.62,33.02
N$35
  Top 0.406: LED1.A 33.56,6.57 R24.1
N$36
  Top 0.406: R25.1 30.7,5.08 LED2.A
N$37  (via drill 0.6)
  Top 0.406: v7.62,30.48 8.26,29.84 OK1.13
  Bottom 0.406: JP9.3 v7.62,30.48
N$38  (via drill 0.6)
  Top 0.406: v7.62,27.94 8.26,28.57 OK1.14
  Bottom 0.406: JP9.4 v7.62,27.94
N$39  (via drill 0.6)
  Top 0.406: v7.62,25.4 9.53,27.3 OK1.15
  Bottom 0.406: JP9.5 v7.62,25.4
N$40  (via drill 0.6)
  Top 0.406: v7.62,22.86 8.89,24.13 8.89,25.4 9.53,26.04 OK1.16
  Bottom 0.406: JP9.6 v7.62,22.86
N$41  (via drill 0.6)
  Top 0.406: OK2.13 9.53,47.62 8.89,48.26 v7.62,48.26
  Bottom 0.406: v7.62,48.26 JP10.3
N$42  (via drill 0.6)
  Top 0.406: OK2.14 9.53,46.35 8.89,45.72 v7.62,45.72
  Bottom 0.406: v7.62,45.72 JP10.4
N$43  (via drill 0.6)
  Top 0.406: OK2.15 9.53,45.09 v7.62,43.18
  Bottom 0.406: v7.62,43.18 JP10.5
N$44  (via drill 0.6)
  Top 0.406: v7.62,40.64 8.89,41.91 8.89,43.18 9.53,43.81 OK2.16
  Bottom 0.406: JP10.6 v7.62,40.64
N$45  (via drill 0.6)
  Top 0.406: OK2.12 9.53,48.9 v7.62,50.8
  Bottom 0.406: v7.62,50.8 JP10.2
N$46  (via drill 0.6)
  Top 0.406: OK2.11 9.53,50.16 8.89,50.8 8.89,52.07 v7.62,53.34
  Bottom 0.406: v7.62,53.34 JP10.1
N$48  (via drill 0.6)
  Top 0.406: v55.88,8.89 52.39,8.89 C26.2
  Bottom 0.406: JP12.1 v55.88,8.89
OC1_A
  Top 0.406: 17.21,25.97 OK1.1 18.41,26.04 19.05,25.4 19.05,24.13 20.32,22.86 24.13,22.86 25.4,24.13 25.4,31.75 26.67,33.02 26.67,34.29 28.01,35.63 U3.14
OC1_B
  Top 0.406: U3.13 26.27,36.43 25.4,35.56 25.4,33.02 24.13,31.75 24.13,29.21 23.5,28.57 OK1.3
OC1_C
  Top 0.406: U3.12 25.8,37.23 22.86,34.29 21.59,34.29 18.41,31.11 OK1.5
OC2_A
  Top 0.406: U3.11 26.74,38.03 25.4,39.37 25.4,40.64 24.13,41.91 19.11,41.91 OK2.1
OC2_B
  Top 0.406: OK2.3 26.04,46.35 26.67,45.72 26.67,39.37 27.21,38.83 U3.10
OC2_C
  Top 0.406: OK2.5 18.41,48.9 19.68,50.16 27.3,50.16 27.94,49.53 27.94,40.64 28.95,39.63 U3.9
RE_1  (via drill 0.6)
  Top 0.406: R10.2 49.53,72.71 R12.1 v57.15,72.39
  Bottom 0.406: JP6.1 59.69,73.66 v57.15,72.39
RE_2  (via drill 0.6)
  Top 0.406: R9.1 50.8,68.26 R11.1 57.15,69.85 v58.42,68.58
  Bottom 0.406: JP6.2 59.69,68.58 v58.42,68.58
RE_BTTN  (via drill 0.6)
  Top 0.406: R13.1 63.5,63.5 65.09,61.91 R32.1 67.31,63.18 v67.31,68.58
  Bottom 0.406: JP6.3 v67.31,68.58
RE_BUTTON  (via drill 0.6)
  Top 0.406: C25.1 R32.2 64.45,60.01 62.23,62.23 58.42,62.23 v57.15,62.23 | U3.2 36.29,42.01 36.51,42.23 39.69,42.23 43.18,45.72 v43.18,62.23
  Bottom 0.406: v43.18,62.23 v57.15,62.23
RESET  (via drill 0.6)
  Top 0.406: U3.29 41.51,37.23 43.18,35.56 v49.53,35.56
  Top 0.61: v44.45,11.43 43.18,10.16 | 43.18,10.16 R8.2 | 43.18,10.16 C1.2
  Bottom 0.406: v44.45,11.43 J1.5 52.07,16.51 55.88,20.32 55.88,22.86 | v49.53,35.56 50.8,35.56 55.88,30.48 55.88,22.86 | JP12.2 JP1.1 JP11.1 60.96,21.59 59.69,22.86 55.88,22.86
RXI  (via drill 0.6)  (1 unrouted)
  Top 0.305: 26.85,11.43 U1.20 | U3.30 41.84,38.03 v43.18,39.37
  Top 0.406: 26.85,11.43 26.67,11.43 | 26.67,11.25 v26.67,10.16
  Bottom 0.305: v43.18,39.37 43.18,38.73 42.55,38.1
  Bottom 0.406: 42.55,38.1 33.02,38.1 31.75,36.83 31.75,13.65 28.57,10.48 28.57,10.16 27.94,9.53 27.3,9.53 v26.67,10.16
SCK  (via drill 0.6)
  Top 0.406: U3.17 31.49,31.49 29.21,29.21 29.21,26.67 33.02,22.86 35.56,22.86 36.83,21.59 36.83,15.24 38.1,13.97 v41.91,13.97
  Bottom 0.406: v41.91,13.97 J1.3
SCL  (via drill 0.6)
  Top 0.406: v69.85,41.91 75.56,36.2 IC2.6 75.56,33.66 76.52,32.7 78.11,32.7 79.38,31.43 IC4.14 | U4.3 75.56,60.33 v74.93,60.96 | U3.28 41.04,36.43 43.18,34.29 51.75,34.29 R16.2 53.66,35.88 54.61,36.83 54.61,38.1 55.88,39.37 v59.69,39.37
  Bottom 0.406: v74.93,60.96 72.39,58.42 72.39,44.45 v69.85,41.91 67.31,44.45 JP7.4 63.5,44.45 59.69,40.64 v59.69,39.37
SDA  (via drill 0.6)
  Top 0.305: R17.2 57.47,35.56 v59.69,35.56
  Top 0.406: v69.85,39.37 73.66,35.56 74.3,35.56 IC2.5 74.3,33.66 76.2,31.75 77.47,31.75 arc-90 78.11,31.11 IC4.15 | U4.6 75.56,51.44 v74.93,50.8 | U3.27 40.57,35.63 43.18,33.02 54.29,33.02 R17.2
  Bottom 0.305: v59.69,35.56 60.96,36.83 60.96,38.1 62.23,39.37
  Bottom 0.406: v74.93,50.8 74.93,44.45 v69.85,39.37 JP7.2 62.23,39.37
TXO  (via drill 0.6)
  Top 0.406: v35.88,14.29 U1.4 | v44.45,41.91 43.18,41.91 40.1,38.83 U3.31
  Bottom 0.406: v35.88,14.29 36.2,14.29 36.51,14.61 36.51,15.56 35.56,16.51 34.92,16.51 33.02,18.41 33.02,34.29 35.56,36.83 43.18,36.83 44.45,38.1 v44.45,41.91
VBUS  (via drill 0.6)
  Top 0.406: v19.05,6.35 R5.2
  Bottom 0.406: v19.05,6.35 19.05,7.62 16.26,10.41 JP4.VBUS
VBUS_SENSE
  Top 0.305: R6.2 25.4,10.48 25.4,12.06 26.99,13.65 U1.18
  Top 0.406: R5.1 R6.2
VCC  (via drill 0.6)
  Top 0.305: U1.15 26.99,15.56 26.67,15.24 26.67,14.29 C19.1
  Top 0.406: R7.1 82.55,42.24 | 83.82,44.45 87.63,44.45 88.9,43.18 v88.9,40.64 | U1.15 29.21,15.56 31.43,13.34 31.43,11.75 31.75,11.43 34.29,11.43 36.51,9.21 R24.2 | 32.38,44.13 32.38,43.18 33.09,42.48 U3.6 33.09,39.94 33.34,39.69 33.66,39.37 34.29,39.37 34.69,39.77 U3.4 34.69,42.31 36.52,44.13 C7.1 | C21.1 32.29,29.43 U3.18 32.38,32.63 32.38,33.66 33.02,34.29 33.34,34.29 33.89,33.74 U3.20 33.89,29.29 C8.1 | v62.23,36.83 61.28,37.78 R17.1 | R16.1 51.12,37.78 v50.8,38.1
  Top 0.61: 82.55,42.24 82.55,43.18 83.82,44.45 v83.82,46.99 | C3.2 75.88,49.21 78.11,51.44 U4.8 80.4,51.12 R1.1 81.28,50.8 | IC2.8 79.85,34.77 C2.1 80.33,40.96 81.28,41.91 82.46,41.91 R7.1 | R24.2 40.64,7.62 41.59,6.67 R8.1 | C20.1 32.07,47.31 33.02,48.26 v36.83,48.26 36.83,44.77 C7.1 | 32.88,62.09 32.88,54.75 v33.02,54.61 | 33.02,34.29 33.34,34.61 33.34,39.69 | C8.1 34.93,28.89 35.88,27.94 35.88,25.08 v39.37,21.59
  Top 0.813: 74.13,27.46 C4.1 74.93,25.08 74.93,13.97 76.83,12.06 76.83,6.35 | 74.13,27.46 IC4.16 | R2.1 82.55,63.5 83.82,62.23 83.82,52.07 82.87,51.12 R1.1 | v69.85,36.83 69.85,33.34 C13.2 69.53,32.06 74.13,27.46 | R25.2 R24.2 | 76.83,6.35 43.5,6.35 R8.1 | 46.99,74.93 46.99,72.71 R12.2 R11.2 47.31,65.72 49.53,63.5 R13.2 52.39,60.96 R28.2 R29.2 54.92,60.33 57.15,60.33 59.05,58.42 59.05,47.62 62.23,44.45 v62.23,36.83 | 76.83,6.35 79.06,4.13 Q2.2
  Top 1.27: C12.1 32.14,69.85 IC3.3 28.89,69.76 29.21,69.44 29.21,66.04 28.98,66.27 D2.A 28.89,63.67 C23.+ 32.88,62.09 35.56,64.77 35.56,67.31 43.18,74.93 46.99,74.93 48.26,76.2 76.2,76.2 80.01,72.39 80.01,63.82 R2.1 | v83.82,46.99 82.23,46.99 C15.2 80.96,50.8 R1.1
  Bottom 0.406: v88.9,40.64 JP5.2 | v62.23,36.83 62.23,35.56 60.96,34.29 54.61,34.29 v50.8,38.1
  Bottom 0.61: v33.02,54.61 33.02,53.34 35.56,50.8 v36.83,48.26 | v39.37,21.59 J1.2
  Bottom 0.813: v69.85,36.83 JP7.1 v62.23,36.83
  Bottom 1.27: v83.82,46.99 85.09,46.99 87.63,49.53 JP8.1

### Text on the board
Top: TOP
Bottom: BOT